# EasyEDA Pro project F405.epro

# Schematic Schematic1
Board Name: Board1; Create Date: 2024-12-15; Page Name: P1; Project Name: F405超微型飞控; Schematic Name: Schematic1; Update Date: 2025-01-16; Company: 嘉立创EDA; Page Size: A4; Version: V1.0
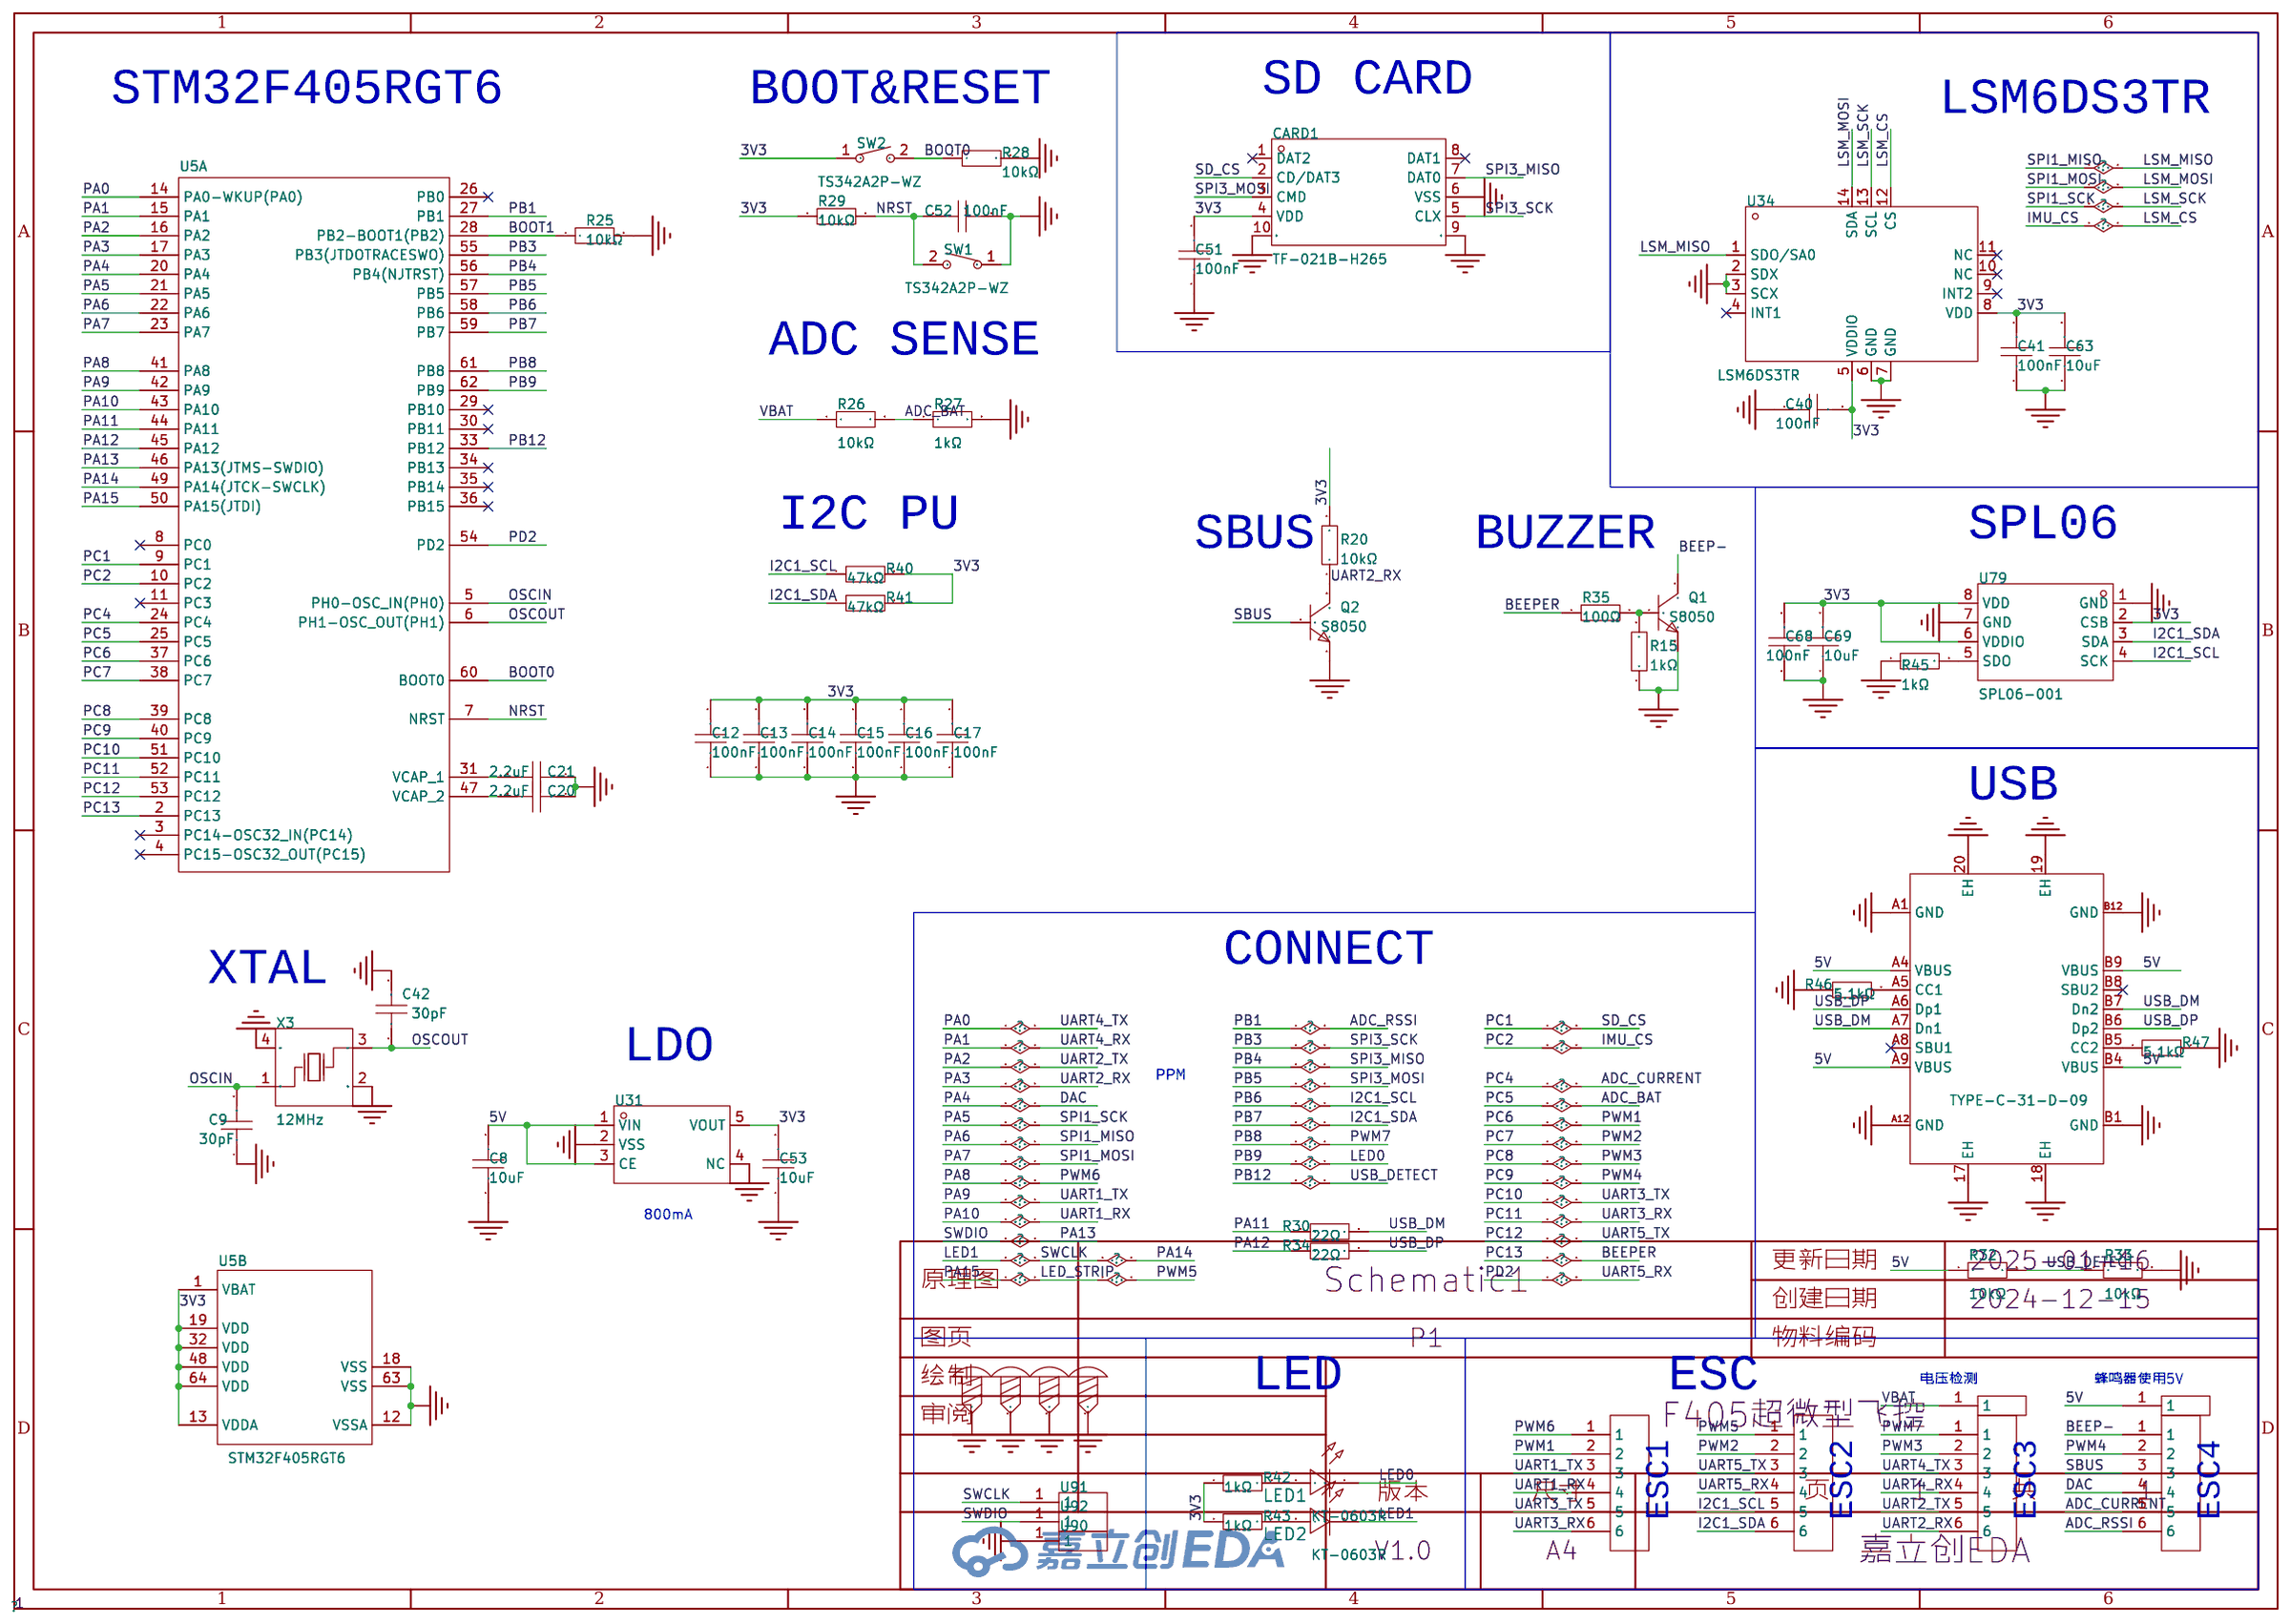
[diagram p0: schematic sheet]

## Parts
C8  10uF  [C0603]
C9  30pF  [C0603]
C12  100nF  [C0603]
C13  100nF  [C0603]
C14  100nF  [C0603]
C15  100nF  [C0603]
C16  100nF  [C0603]
C17  100nF  [C0603]
C20  2.2uF  [C0603]
C21  2.2uF  [C0603]
C40  100nF  [C0603]
C41  100nF  [C0603]
C42  30pF  [C0603]
C51  100nF  [C0603]
C52  100nF  [C0603]
C53  10uF  [C0603]
C63  10uF  [C0603]
C68  100nF  [C0603]
C69  10uF  [C0603]
CARD1  TF-021B-H265  [TF-SMD_TF-021B-H265]
LED1  KT-0603R  [LED0603-RD]
LED2  KT-0603R  [LED0603-RD]
Q1  S8050  [SOT-23-3_L2.9-W1.3-P1.90-LS2.4-BR]
Q2  S8050  [SOT-23-3_L2.9-W1.3-P1.90-LS2.4-BR]
R15  1kΩ  [R0603]
R20  10kΩ  [R0603]
R25  10kΩ  [R0603]
R26  10kΩ  [R0603]
R27  1kΩ  [R0603]
R28  10kΩ  [R0603]
R29  10kΩ  [R0603]
R30  22Ω  [R0603]
R32  10kΩ  [R0603]
R33  10kΩ  [R0603]
R34  22Ω  [R0603]
R35  100Ω  [R0603]
R40  47kΩ  [R0603]
R41  47kΩ  [R0603]
R42  1kΩ  [R0603]
R43  1kΩ  [R0603]
R45  1kΩ  [R0603]
R46  5.1kΩ  [R0603]
R47  5.1kΩ  [R0603]
SCREW1  -  [M3螺丝]
SCREW2  -  [M3螺丝]
SCREW3  -  [M3螺丝]
SCREW4  -  [M3螺丝]
SW1  TS342A2P-WZ  [SW-SMD_L4.0-W2.9-LS5.0]
SW2  TS342A2P-WZ  [SW-SMD_L4.0-W2.9-LS5.0]
U5  STM32F405RGT6  [LQFP-64_L10.0-W10.0-P0.50-LS12.0-BL]  (sections 1,2)
U31  ME6217C33M5G  [SOT-23-5_L3.0-W1.7-P0.95-LS2.8-BR]
U34  LSM6DS3TR  [LGA-14_L3.0-W2.5-P0.50-TL]
U79  SPL06-001  [SENSOR-SMD_SPL06-001]
U83  -  [6pin焊接引出]
U84  -  [6pin焊接引出]
U86  -  [6pin焊接引出]
U87  -  [6pin焊接引出]
U89  TYPE-C-31-D-09  [USB-C-TH_TYPE-C-31-D-09]
U90  -  [1pin焊接引出]
U91  -  [1pin焊接引出]
U92  -  [1pin焊接引出]
U93  -  [1pin焊接引出]
U94  -  [1pin焊接引出]
X3  12MHz  [CRYSTAL-SMD_4P-L3.2-W2.5-BL]

## Library data of the parts
C8 C53 C63 C69 = CL10A106KP8NNNC: 容值:10uF;精度:±10%;额定电压:10V;材质(温度系数):X5R;; LCSC Part Name: 10uF ±10% 10V; Supplier Part: C19702; Manufacturer: SAMSUNG(三星); Supplier Footprint: 0603; JLCPCB Part Class: Basic Part; Datasheet: https://atta.szlcsc.com/upload/public/pdf/source/20160218/1457707763339.pdf; Supplier: LCSC; Tolerance: ±10%; Voltage Rated: 10V; Temperature Coefficient: X5R
C9 C42 = 0603CG300J500NT: 容值:30pF;精度:±5%;额定电压:50V;材质(温度系数):C0G;; LCSC Part Name: 30pF ±5% 50V; Supplier Part: C1658; Manufacturer: FH(风华); Supplier Footprint: 0603; JLCPCB Part Class: Basic Part; Datasheet: https://atta.szlcsc.com/upload/public/pdf/source/20170923/C1658_1506149307366988446.pdf; Supplier: LCSC; Tolerance: ±5%; Voltage Rated: 50V; Temperature Coefficient: C0G
C12-C17 C40 C41 C51 C52 C68 = CC0603KRX7R9BB104: 容值:100nF;精度:±10%;额定电压:50V;材质(温度系数):X7R;; LCSC Part Name: 100nF ±10% 50V; Supplier Part: C14663; Manufacturer: YAGEO(国巨); Supplier Footprint: 0603; JLCPCB Part Class: Basic Part; Datasheet: https://atta.szlcsc.com/upload/public/pdf/source/20180910/C282072_33301C7F631E79921B82A8DAC6BCC5B3.pdf; Supplier: LCSC; Tolerance: ±10%; Voltage Rated: 50V; Temperature Coefficient: X7R
C20 C21 = CL10A225KO8NNNC: 容值:2.2uF;精度:±10%;额定电压:16V;材质(温度系数):X5R;; LCSC Part Name: 2.2uF ±10% 16V; Supplier Part: C23630; Manufacturer: SAMSUNG(三星); Supplier Footprint: 0603; JLCPCB Part Class: Basic Part; Datasheet: https://atta.szlcsc.com/upload/public/pdf/source/20160218/1457707763339.pdf; Supplier: LCSC; Tolerance: ±10%; Voltage Rated: 16V; Temperature Coefficient: X5R
CARD1 = TF-021B-H265: 卡连接方式:拔插式;卡类型:MicroSD卡(TF卡);连接器类型:卡座;本体最大高度:2.5mm;工作温度范围:-25℃~+75℃;; LCSC Part Name: 拔插式 MicroSD卡(TF卡) 卡座; Supplier Part: C498185; Manufacturer: SOFNG(硕方); Supplier Footprint: SMD; JLCPCB Part Class: 扩展库; Datasheet: https://atta.szlcsc.com/upload/public/pdf/source/20200318/C498185_790264C8C4D0E25CCBD64FEBD13A33FF.pdf; Supplier: LCSC; Card Connection Mode: 拔插式; Card Type: MicroSD卡(TF卡); Connector Type: 卡座; Maximum Body Height: 2.5mm; Operating Temperature Range: -25℃~+75℃
LED1 LED2 = KT-0603R: 发光颜色:红色;功率:-;正向电流:-;主波长:-;二极管配置:-;透镜颜色:-;色温:-;发光角度:-;载带方式:-;工作温度:-40℃~+85℃;; LCSC Part Name: 0603 红灯 高亮; Supplier Part: C2286; Manufacturer: KENTO; Supplier Footprint: 0603; JLCPCB Part Class: Basic Part; Datasheet: https://atta.szlcsc.com/upload/public/pdf/source/20160616/1466072038404.pdf; Supplier: LCSC; Emitted Color: 红色; Operating Temperature: -40℃~+85℃
Q1 Q2 = S8050_C2891804: 晶体管类型:NPN;集电极电流(Ic):500mA;集射极击穿电压(Vceo):25V;功率(Pd):300mW;; LCSC Part Name: NPN 电流:500mA 耐压:25V; Supplier Part: C2891804; Manufacturer: YONGYUTAI(永裕泰); Supplier Footprint: SOT-23; JLCPCB Part Class: 扩展库; Datasheet: https://atta.szlcsc.com/upload/public/pdf/source/20210901/5347316A10609C628D4D69AE01446E5B.pdf; Supplier: LCSC; Transistor Type: NPN; Collector Current (Ic): 500mA; Collector-Emitter Breakdown Voltage (Vceo): 25V; Power Dissipation (Pd): 300mW; Collector Cut-Off Current (Icbo): 1uA; Collector-Emitter Saturation Voltage (VCE(sat)@Ic,Ib): 500mV@500mA,50mA
R15 R27 R42 R43 R45 = 0603WAF1001T5E: 电阻类型:厚膜电阻;阻值:1kΩ;精度:±1%;功率:100mW;最大工作电压:75V;温度系数:±100ppm/℃;; LCSC Part Name: 1kΩ ±1% 100mW 厚膜电阻; Supplier Part: C21190; Manufacturer: UNI-ROYAL(厚声); Supplier Footprint: 0603; JLCPCB Part Class: Basic Part; Datasheet: https://atta.szlcsc.com/upload/public/pdf/source/20200306/C422600_1E6D84923E4A46A82E41ADD87F860B5C.pdf; Supplier: LCSC; Type: 厚膜电阻; Tolerance: ±1%; Power(Watts): 100mW; Overload Voltage (Max): 75V; Temperature Coefficient: ±100ppm/℃; Operating Temperature Range: -55℃~+155℃
R20 R25 R26 R28 R29 R32 R33 = 0603WAF1002T5E: 电阻类型:厚膜电阻;阻值:10kΩ;精度:±1%;功率:100mW;最大工作电压:75V;温度系数:±100ppm/℃;; LCSC Part Name: 厚膜电阻 10kΩ ±1% 100mW; Supplier Part: C25804; Manufacturer: UNI-ROYAL(厚声); Supplier Footprint: 0603; JLCPCB Part Class: Basic Part; Datasheet: https://atta.szlcsc.com/upload/public/pdf/source/20200306/C422600_1E6D84923E4A46A82E41ADD87F860B5C.pdf; Supplier: LCSC; Type: 厚膜电阻; Tolerance: ±1%; Power(Watts): 100mW; Overload Voltage (Max): 75V; Temperature Coefficient: ±100ppm/℃; Operating Temperature Range: -55℃~+155℃
R30 R34 = 0603WAF220JT5E: 电阻类型:厚膜电阻;阻值:22Ω;精度:±1%;功率:100mW;最大工作电压:75V;温度系数:±100ppm/℃;; LCSC Part Name: 22Ω ±1% 100mW 厚膜电阻; Supplier Part: C23345; Manufacturer: UNI-ROYAL(厚声); Supplier Footprint: 0603; JLCPCB Part Class: Basic Part; Datasheet: https://atta.szlcsc.com/upload/public/pdf/source/20200306/C422600_1E6D84923E4A46A82E41ADD87F860B5C.pdf; Supplier: LCSC; Type: 厚膜电阻; Tolerance: ±1%; Power(Watts): 100mW; Overload Voltage (Max): 75V; Temperature Coefficient: ±100ppm/℃; Operating Temperature Range: -55℃~+155℃
R35 = 0603WAF1000T5E: 电阻类型:厚膜电阻;阻值:100Ω;精度:±1%;功率:100mW;最大工作电压:75V;温度系数:±200ppm/℃;; LCSC Part Name: 100Ω ±1% 100mW 厚膜电阻; Supplier Part: C22775; Manufacturer: UNI-ROYAL(厚声); Supplier Footprint: 0603; JLCPCB Part Class: Basic Part; Datasheet: https://atta.szlcsc.com/upload/public/pdf/source/20200306/C422600_1E6D84923E4A46A82E41ADD87F860B5C.pdf; Supplier: LCSC; Type: 厚膜电阻; Tolerance: ±1%; Power(Watts): 100mW; Overload Voltage (Max): 75V; Temperature Coefficient: ±200ppm/℃; Operating Temperature Range: -55℃~+155℃
R40 R41 = 0603WAF4702T5E: 电阻类型:厚膜电阻;阻值:47kΩ;精度:±1%;功率:100mW;最大工作电压:75V;温度系数:±100ppm/℃;; LCSC Part Name: 47kΩ ±1% 100mW 厚膜电阻; Supplier Part: C25819; Manufacturer: UNI-ROYAL(厚声); Supplier Footprint: 0603; JLCPCB Part Class: Basic Part; Datasheet: https://atta.szlcsc.com/upload/public/pdf/source/20200306/C422600_1E6D84923E4A46A82E41ADD87F860B5C.pdf; Supplier: LCSC; Type: 厚膜电阻; Tolerance: ±1%; Power(Watts): 100mW; Overload Voltage (Max): 75V; Temperature Coefficient: ±100ppm/℃; Operating Temperature Range: -55℃~+155℃
R46 R47 = 0603WAF5101T5E: 电阻类型:厚膜电阻;阻值:5.1kΩ;精度:±1%;功率:100mW;最大工作电压:75V;温度系数:±100ppm/℃;; LCSC Part Name: 5.1kΩ ±1% 100mW 厚膜电阻; Supplier Part: C23186; Manufacturer: UNI-ROYAL(厚声); Supplier Footprint: 0603; JLCPCB Part Class: Basic Part; Datasheet: https://atta.szlcsc.com/upload/public/pdf/source/20200306/C422600_1E6D84923E4A46A82E41ADD87F860B5C.pdf; Supplier: LCSC; Type: 厚膜电阻; Tolerance: ±1%; Power(Watts): 100mW; Overload Voltage (Max): 75V; Temperature Coefficient: ±100ppm/℃; Operating Temperature Range: -55℃~+155℃
SCREW1-SCREW4 = M3螺丝: Supplier Footprint: 插件; Check: false
SW1 SW2 = TS342A2P-WZ: 电路结构:单刀单掷;按钮形状:圆形按钮;安装方式:立贴;开关长度:3.95mm;开关宽度:2.9mm;开关高度:2mm;带支架:不带;触点电流:50mA;额定电压(DC):12V;绝缘电阻:100MΩ;机械寿命:3万次;; LCSC Part Name: 3.95*2.9*2mm 立贴 轻触开关; Supplier Part: C557591; Manufacturer: SHOU HAN(首韩); Supplier Footprint: SMD; JLCPCB Part Class: 扩展库; Datasheet: https://atta.szlcsc.com/upload/public/pdf/source/20200519/C557591_B3A5A21584733303F06306F18577DA8B.pdf; Supplier: LCSC; Circuit: 单刀单掷; Actuator Style: 圆形按钮; Mounting Style: 立贴; Switch Length: 3.95mm; Switch Width: 2.9mm; Switch Height: 2mm; Strike Gundam: 不带; Contact Current: 50mA; Voltage Rating (DC): 12V; Insulation Resistance: 100MΩ; Actuator/Cap Color: 黑色; Pin Style: SMD接片; Mechanical Life: 3万次; Operating Temperature: -25℃~+70℃
U5 = STM32F405RGT6: CPU内核:ARM Cortex-M4;CPU最大主频:168MHz;工作电压范围:1.8V~3.6V;内部振荡器:有;程序 FLASH容量:1MB;RAM总容量:192KB;EEPROM/数据 FLASH容量:-;GPIO端口数量:51;ADC(单元数/通道数/位数):1@x16ch/12bit;DAC(单元数/通道数/位数):1@x2ch/12bit;外设/功能/协议栈:欠压检测/复位；DMA；LCD驱动；看门狗；POR；PWM;工作温度范围:-40℃~+85℃;; LCSC Part Name: ARM Cortex-M4 168MHz 闪存：1MB RAM：192KB; Supplier Part: C15742; Manufacturer: ST(意法半导体); Supplier Footprint: LQFP-64(10x10); JLCPCB Part Class: 扩展库; Datasheet: https://atta.szlcsc.com/upload/public/pdf/source/20140724/1457707160365.pdf; Supplier: LCSC; CPU Core: ARM Cortex-M4; CPU Maximum Speed: 168MHz; Operating Voltage Range: 1.8V~3.6V; Program Storage Size: 1MB; Program Memory Type: FLASH; RAM Size: 192KB; GPIO Ports Number: 51; ADC (Bit): 12bit; DAC (Bit): 12bit; Universal Serial Bus: 有; Peripheral/Function: DMA；LCD/LED驱动；PWM; Watchdog: 有; Infrared Data Association: 有; Low-Voltage Detect: 有; LCD Module: 有; Direct Memory Access: 有; Internal Oscillator: 有; Operating Temperature Range: -40℃~+85℃; Maximum Frequency: 168MHz; Supply Voltage Range: 1.8V~3.6V; Program FLASH Size: 1MB; ADC (Units/Channels/bits): 1@x16ch/12bit; DAC (Units/Channels/bits): 1@x2ch/12bit; Peripherals / Functions / Protocol Stacks: 欠压检测/复位；DMA；LCD驱动；看门狗；POR；PWM
U31 = ME6217C33M5G: 输出类型:固定;输出极性:正;最大输入电压:7V;输出电压:3.3V;输出电流:800mA;电源纹波抑制比(PSRR):65dB@(1kHz);; Supplier Part: C427602; Manufacturer: MICRONE(南京微盟); Supplier Footprint: SOT-23-5; JLCPCB Part Class: 扩展库; Datasheet: https://atta.szlcsc.com/upload/public/pdf/source/20190910/C427602_D4B9162A2E9D9EF57C60010DFDECEF37.pdf; Supplier: LCSC; Output Type: 固定; Output Polarity: 正; Number of Outputs: 1; Maximum Input Voltage: 7V; Output Voltage: 3.3V; Dropout Voltage: 180mV@(300mA); Output Current: 800mA; Power Supply Rejection Ratio (PSRR): 65dB@(1kHz)
U34 = LSM6DS3TR: 传感器类型:加速度计陀螺仪;; LCSC Part Name: LSM6DS3TR MSL=3; Supplier Part: C95230; Manufacturer: ST(意法半导体); Supplier Footprint: LGA-14(2.5x3); JLCPCB Part Class: 扩展库; Datasheet: https://atta.szlcsc.com/upload/public/pdf/source/20180410/C95230_E9546B888C12D8CC6F7F231B3BE24882.pdf; Supplier: LCSC; Sensor Type: 加速度计陀螺仪; Operating Temperature: -40℃~+85℃
U79 = SPL06-001_C2684428: LCSC Part Name: 普通气压传感器 停产; Supplier Part: C2684428; Manufacturer: Goertek(歌尔); Supplier Footprint: LGA-8(2x2.5); JLCPCB Part Class: 扩展库; Datasheet: https://atta.szlcsc.com/upload/public/pdf/source/20210120/C2684428_7EA58BBCA3793458F617124FBE4BF8F1.pdf; Supplier: LCSC; Operating Temperature: -40℃~+85℃
U83 U84 U86 U87 = 6pin焊接引出: Check: false
U89 = TYPE-C-31-D-09_C7463258: 连接器类型:Type-C;公母:母;触点数量:16P;端口数量:1;触头材质:磷青铜;触头镀层:金;工作温度范围:-25℃~+85℃;焊接温度(最大值):255℃;; LCSC Part Name: Type-C 母; Supplier Part: C7463258; Manufacturer: 韩国韩荣; Supplier Footprint: 插件; JLCPCB Part Class: 扩展库; Datasheet: https://atta.szlcsc.com/upload/public/pdf/source/20210810/32473655767ED7E058BB8A709ED63A8A.pdf; Supplier: LCSC; Connector Type: Type-C; Gender: 母; Number of Contacts: 16P; Number of Ports: 1; Contact Material: 磷青铜; Contact Plating: 金; Operating Temperature Range: -25℃~+85℃; Soldering Temperature(Max): 255℃
U90-U94 = 1pin焊接引出: Check: false
X3 = X322512MSB4SI: 晶振类型:贴片晶振;频率:12MHz;常温频差:±10ppm;外接负载电容:20pF;频率稳定度(全温):±20ppm;; LCSC Part Name: 12MHz ±10ppm 20pF; Supplier Part: C9002; Manufacturer: YXC(扬兴晶振); Supplier Footprint: SMD3225-4P; JLCPCB Part Class: 基础库; Datasheet: https://atta.szlcsc.com/upload/public/pdf/source/20240329/19D5F850207469550BEB00D7DFEDBC7A.pdf; Supplier: LCSC; Crystal Type: 贴片晶振; Normal temperature Frequency Tolerance: ±10ppm; External load capacitor: 20pF; Frequency Stability(Full temperature range): ±20ppm; Operating Temperature: -40℃~+85℃

## Nets
3V3: C12.2 C13.2 C14.2 C15.2 C16.2 C17.2 C40.2 C41.2 C51.2 C53.2 C63.2 C68.2 C69.2 CARD1.4(VDD) R20.2 R29.1 R40.2 R41.2 R42.1 R43.1 SW2.1 U5.1(VBAT) U5.13(VDDA) U5.19(VDD) U5.32(VDD) U5.48(VDD) U5.64(VDD) U31.5(VOUT) U34.5(VDDIO) U34.8(VDD) U79.2(CSB) U79.6(VDDIO) U79.8(VDD)
5V: C8.2 R32.1 U31.1(VIN) U31.3(CE) U89.A4(VBUS) U89.A9(VBUS) U89.B4(VBUS) U89.B9(VBUS) U93.1
GND: C8.1 C9.1 C12.1 C13.1 C14.1 C15.1 C16.1 C17.1 C20.1 C21.1 C40.1 C41.1 C42.2 C51.1 C52.2 C53.1 C63.1 C68.1 C69.1 CARD1.6(VSS) CARD1.9 CARD1.10 Q1.2(E) Q2.2(E) R15.1 R25.2 R27.2 R28.2 R33.2 R45.1 R46.1 R47.2 SCREW1.1 SCREW2.1 SCREW3.1 SCREW4.1 SW1.1 U5.12(VSSA) U5.18(VSS) U5.63(VSS) U31.2(VSS) U31.4(NC) U34.2(SDX) U34.3(SCX) U34.6(GND) U34.7(GND) U79.1(GND) U79.7(GND) U89.17(EH) U89.18(EH) U89.19(EH) U89.20(EH) U89.A1(GND) U89.A12(GND) U89.B1(GND) U89.B12(GND) U90.1 X3.2(GND) X3.4(GND)
VBAT: R26.1 U94.1
ADC_BAT: R26.2 R27.1 U5.25(PC5)
ADC_CURRENT: U5.24(PC4) U86.5
ADC_RSSI: U5.27(PB1) U86.6
BEEP-: Q1.3(C) U86.1
BEEPER: R35.1 U5.2(PC13)
BOOT0: R28.1 SW2.2 U5.60(BOOT0)
BOOT1: R25.1 U5.28(PB2-BOOT1(PB2))
DAC: U5.20(PA4) U86.4
I2C1_SCL: R40.1 U5.58(PB6) U79.4(SCK) U84.5
I2C1_SDA: R41.1 U5.59(PB7) U79.3(SDA) U84.6
IMU_CS: U5.10(PC2) U34.12(CS)
LED0: LED1.1(C) U5.62(PB9)
LED1: LED2.1(C) U5.49(PA14(JTCK-SWCLK)) U91.1
LED_STRIP: U5.50(PA15(JTDI)) U84.1
LSM_MISO: U5.22(PA6) U34.1(SDO/SA0)
LSM_MOSI: U5.23(PA7) U34.14(SDA)
LSM_SCK: U5.21(PA5) U34.13(SCL)
NRST: C52.1 R29.2 SW1.2 U5.7(NRST)
OSCIN: C9.2 U5.5(PH0-OSC_IN(PH0)) X3.1(OSC1)
OSCOUT: C42.1 U5.6(PH1-OSC_OUT(PH1)) X3.3(OSC2)
PA0: U5.14(PA0-WKUP(PA0)) U87.3
PA1: U5.15(PA1) U87.4
PA2: U5.16(PA2) U87.5
PA3: Q2.3(C) R20.1 U5.17(PA3) U87.6
PA8: U5.41(PA8) U83.1
PA9: U5.42(PA9) U83.3
PA10: U5.43(PA10) U83.4
PA11: R30.1 U5.44(PA11)
PA12: R34.1 U5.45(PA12)
PA13: U5.46(PA13(JTMS-SWDIO)) U92.1
PB3: CARD1.5(CLX) U5.55(PB3(JTDOTRACESWO))
PB4: CARD1.7(DAT0) U5.56(PB4(NJTRST))
PB5: CARD1.3(CMD) U5.57(PB5)
PB8: U5.61(PB8) U87.1
PB12: R32.2 R33.1 U5.33(PB12)
PC1: CARD1.2(CD/DAT3) U5.9(PC1)
PC6: U5.37(PC6) U83.2
PC7: U5.38(PC7) U84.2
PC8: U5.39(PC8) U87.2
PC9: U5.40(PC9) U86.2
PC10: U5.51(PC10) U83.5
PC11: U5.52(PC11) U83.6
PC12: U5.53(PC12) U84.3
PD2: U5.54(PD2) U84.4
SBUS: Q2.1(B) U86.3
USB_DM: R30.2 U89.A7(Dn1) U89.B7(Dn2)
USB_DP: R34.2 U89.A6(Dp1) U89.B6(Dp2)
$1N7139: C20.2 U5.47(VCAP_2)
$1N7140: C21.2 U5.31(VCAP_1)
$1N7387: Q1.1(B) R15.2 R35.2
$1N7752: LED1.2(A) R42.2
$1N7753: LED2.2(A) R43.2
$1N11868: R45.2 U79.5(SDO)
$1N12580: R46.2 U89.A5(CC1)
$1N12606: R47.1 U89.B5(CC2)

Not connected (* = marked no-connect by the designer): CARD1 1(DAT2)* 8(DAT1)*; U5 3(PC14-OSC32_IN(PC14))* 4(PC15-OSC32_OUT(PC15))* 8(PC0)* 11(PC3)* 26(PB0)* 29(PB10)* 30(PB11)* 34(PB13)* 35(PB14)* 36(PB15)*; U34 4(INT1)* 9(INT2)* 10(NC)* 11(NC)*; U89 A8(SBU1)* B8(SBU2)*

## Notes on the sheet
- SD CARD
- STM32F405RGT6
- BOOT&RESET
- LSM6DS3TR
- ADC SENSE
- I2C PU
- SBUS
- BUZZER
- SPL06
- USB
- CONNECT
- XTAL
- LDO
- PPM
- 800mA
- 电压检测
- 蜂鸣器使用5V
- LED
- ESC
- ESC1
- ESC2
- ESC3
- ESC4

# Board PCB1
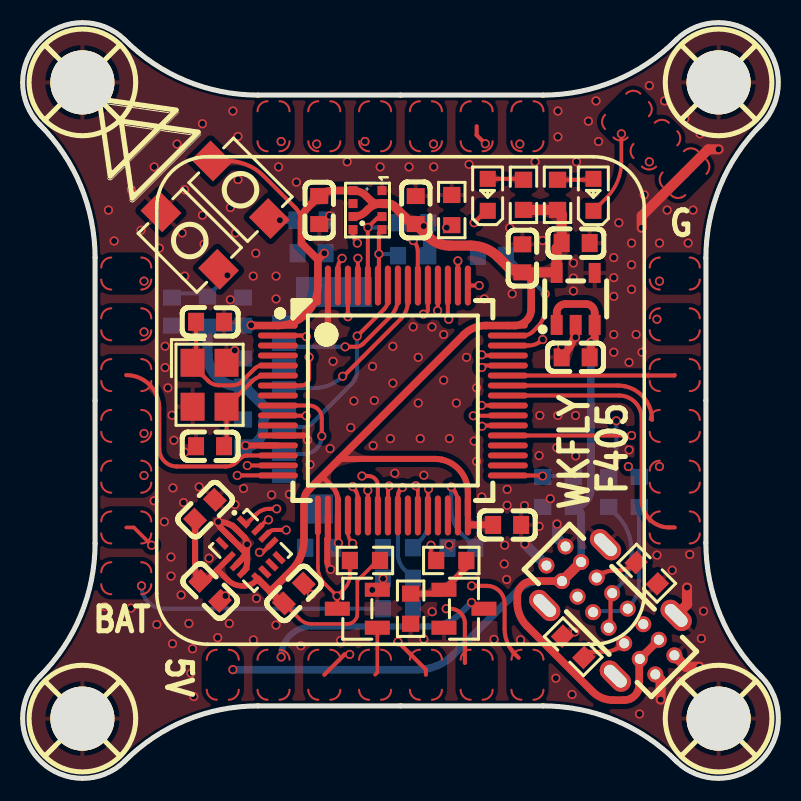
[diagram p1: board, top side]
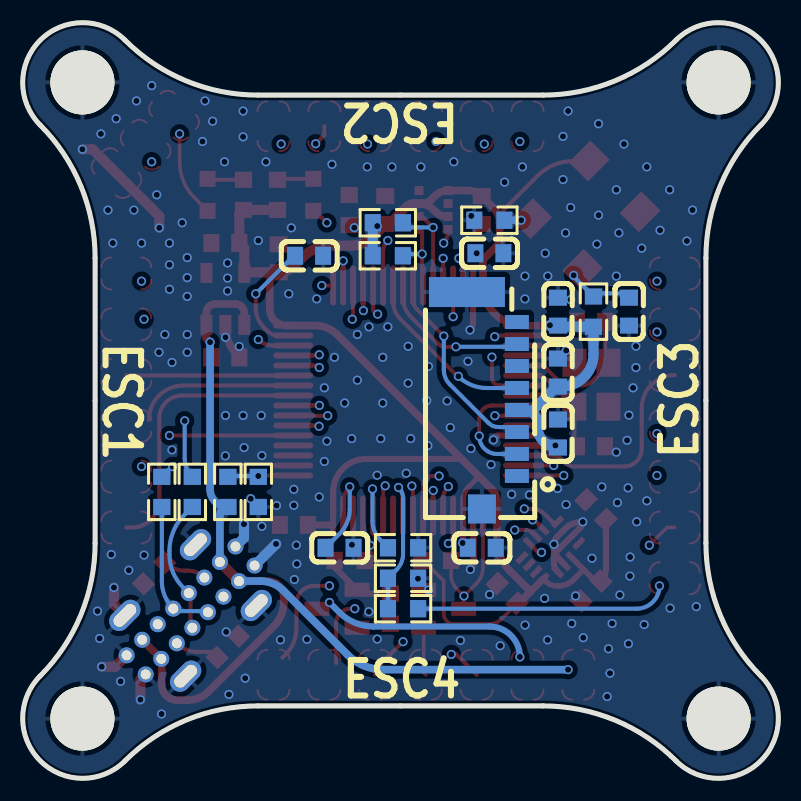
[diagram p2: board, bottom side, seen from below]

Outline 37.82 x 37.82 mm; copper layers: Top Layer, Inner1, Inner2, Bottom Layer. Coordinates in mm from the lower left corner of the outline.
Outline path: 0.88,32.7 arc(2.92,29.65) 3.64,26.05 3.64,11.78 arc(2.92,8.18) 0.88,5.12 arc(0.88,0.88) 5.12,0.88 arc(8.18,2.92) 11.78,3.64 26.05,3.64 arc(29.65,2.92) 32.7,0.88 arc(36.94,0.88) 36.94,5.12 arc(34.9,8.18) 34.19,11.78 34.19,26.05 arc(34.9,29.65) 36.94,32.7 arc(36.94,36.94) 32.7,36.94 arc(29.65,34.9) 26.05,34.19 11.78,34.19 arc(8.18,34.9) 5.12,36.94 arc(0.88,36.94) 0.88,32.7
Stack: Top Layer 0.035mm 外层铜厚1oz / Dielectric1 0.2104mm 7628 RC49% 8.6mil / Inner1 0.0152mm 内层铜厚 / Dielectric2 1.065mm 1.1mm H/HOZ Copper / Inner2 0.0152mm 内层铜厚 / Dielectric3 0.2104mm 7628 RC49% 8.6mil / Bottom Layer 0.035mm 外层铜厚1oz

## Design rules (mm)
template: 自定义配置
spacing copperThickness1oz (default): track to track 0.102, other pairs 0.152 to 0.3
spacing copperThickness2oz: track to track 0.203, other pairs 0.152 to 0.3
track width copperThickness1oz (default): min 0.127, default 0.254, max 2.54
track width copperThickness2oz: min 0.203, default 0.254, max 2.54
differential pair differentialPair (default): width min 0.127, default 0.254, max 2.54; gap min 0.152, default 0.152
via viaSize (default): diameter min 0.254, default 0.457, max 10; hole min 0.3, default 0.305, max 6.3

## Placement (name value [footprint] x y rotation side)
C8  10uF  [C0603]  27.67 21.07 0 top
C9  30pF  [C0603]  9.39 22.85 180 top
C12  100nF  [C0603]  11.04 17.26 270 bottom
C13  100nF  [C0603]  27.67 26.79 180 top
C14  100nF  [C0603]  24.25 12.69 180 top
C15  100nF  [C0603]  14.85 11.55 0 bottom
C16  100nF  [C0603]  11.04 23.36 270 bottom
C17  100nF  [C0603]  14.47 26.28 0 bottom
C20  2.2uF  [C0603]  23.48 26.15 0 bottom
C21  2.2uF  [C0603]  21.96 11.55 0 bottom
C40  100nF  [C0603]  9.13 13.45 225 top
C41  100nF  [C0603]  9.39 9.39 135 top
C42  30pF  [C0603]  9.39 16.63 180 top
C51  100nF  [C0603]  11.04 20.31 270 bottom
C52  100nF  [C0603]  7.48 23.36 270 bottom
C53  10uF  [C0603]  25.01 26.02 270 top
C63  10uF  [C0603]  13.58 9.26 225 top
C68  100nF  [C0603]  19.67 28.44 270 top
C69  10uF  [C0603]  14.85 28.44 90 top
CARD1  TF-021B-H265  [TF-SMD_TF-021B-H265]  14.34 18.91 270 bottom
LED1  KT-0603R  [LED0603-RD]  23.27 29.2 90 top
LED2  KT-0603R  [LED0603-RD]  28.56 29.2 90 top
Q1  S8050  [SOT-23-3_L2.9-W1.3-P1.90-LS2.4-BR]  22.09 8.5 180 top
Q2  S8050  [SOT-23-3_L2.9-W1.3-P1.90-LS2.4-BR]  16.75 8.5 0 top
R15  1kΩ  [R0603]  19.42 8.5 90 top
R20  10kΩ  [R0603]  17.13 10.91 0 top
R25  10kΩ  [R0603]  18.78 11.55 180 bottom
R26  10kΩ  [R0603]  18.78 8.5 0 bottom
R27  1kΩ  [R0603]  18.78 10.02 180 bottom
R28  10kΩ  [R0603]  14.47 27.93 0 bottom
R29  10kΩ  [R0603]  9.26 23.36 90 bottom
R30  22Ω  [R0603]  30.85 14.34 270 bottom
R32  10kΩ  [R0603]  27.55 14.34 90 bottom
R33  10kΩ  [R0603]  26.02 14.34 270 bottom
R34  22Ω  [R0603]  29.33 14.34 270 bottom
R35  100Ω  [R0603]  21.45 10.91 0 top
R40  47kΩ  [R0603]  19.55 26.15 0 bottom
R41  47kΩ  [R0603]  19.55 27.8 0 bottom
R42  1kΩ  [R0603]  25.06 29.2 90 top
R43  1kΩ  [R0603]  26.77 29.2 90 top
R45  1kΩ  [R0603]  21.48 28.44 270 top
R46  5.1kΩ  [R0603]  27.55 6.59 315 top
R47  5.1kΩ  [R0603]  31.23 10.28 315 top
SCREW1  -  [M3螺丝]  34.82 34.82 0 top
SCREW2  -  [M3螺丝]  34.82 3 0 top
SCREW3  -  [M3螺丝]  3 3 0 top
SCREW4  -  [M3螺丝]  3 34.82 0 top
SW1  TS342A2P-WZ  [SW-SMD_L4.0-W2.9-LS5.0]  8.37 26.91 315 top
SW2  TS342A2P-WZ  [SW-SMD_L4.0-W2.9-LS5.0]  10.91 29.45 315 top
U5  STM32F405RGT6  [LQFP-64_L10.0-W10.0-P0.50-LS12.0-BL]  18.53 18.91 270 top
U31  ME6217C33M5G  [SOT-23-5_L3.0-W1.7-P0.95-LS2.8-BR]  27.67 23.99 270 top
U34  LSM6DS3TR  [LGA-14_L3.0-W2.5-P0.50-TL]  11.41 11.41 315 top
U79  SPL06-001  [SENSOR-SMD_SPL06-001]  17.26 28.44 90 top
U83  -  [6pin焊接引出]  32.63 16.37 0 top
U84  -  [6pin焊接引出]  21.45 32.63 90 top
U86  -  [6pin焊接引出]  16.37 5.2 270 top
U87  -  [6pin焊接引出]  5.2 21.45 180 top
U89  TYPE-C-31-D-09  [USB-C-TH_TYPE-C-31-D-09]  29.41 8.41 135 top
U90  -  [1pin焊接引出]  33.12 30.28 45 top
U91  -  [1pin焊接引出]  30.24 33.16 45 top
U92  -  [1pin焊接引出]  31.66 31.71 45 top
U93  -  [1pin焊接引出]  10.02 5.2 90 top
U94  -  [1pin焊接引出]  5.2 10.02 0 top
X3  12MHz  [CRYSTAL-SMD_4P-L3.2-W2.5-BL]  9.36 19.7 270 top

## Footprints (pads in the part's own frame, mm; a bottom-side part is the same pattern mirrored in y, then rotated)
1pin焊接引出
  custom 2.5x1.6 smd: 1(0,0)
6pin焊接引出
  custom 2.5x1.6 smd: 1(0,-3.81) 2(0,-1.27) 3(0,1.27) 4(0,3.81) 5(0,6.35) 6(0,8.89)
C0603
  rect 0.8x0.9 smd: 1(-0.7,0) 2(0.7,0)
CRYSTAL-SMD_4P-L3.2-W2.5-BL
  rect 1.4x1.2 smd: 1(-1.1,-0.85) 2(1.1,-0.85) 3(1.1,0.85) 4(-1.1,0.85)
LED0603-RD
  rect 0.8x0.8 smd: 1(-0.799,0) 2(0.799,0)
LGA-14_L3.0-W2.5-P0.50-TL
  rect 0.675x0.28 smd: 1(-1.262,0.75) 2(-1.262,0.25) 3(-1.262,-0.25) 4(-1.262,-0.75) 8(1.262,-0.75) 9(1.262,-0.25) 10(1.262,0.25) 11(1.262,0.75)
  rect 0.28x0.675 smd: 5(-0.5,-1.012) 6(0,-1.013) 7(0.5,-1.012) 12(0.5,1.012) 13(0,1.013) 14(-0.5,1.012)
LQFP-64_L10.0-W10.0-P0.50-LS12.0-BL
  oval 0.3x2 smd: 1(-3.75,-5.75) 2(-3.25,-5.75) 3(-2.75,-5.75) 4(-2.25,-5.75) 5(-1.75,-5.75) 6(-1.25,-5.75) 7(-0.75,-5.75) 8(-0.25,-5.75) 9(0.25,-5.75) 10(0.75,-5.75) 11(1.25,-5.75) 12(1.75,-5.75) 13(2.25,-5.75) 14(2.75,-5.75) 15(3.25,-5.75) 16(3.75,-5.75) 33(3.75,5.75) 34(3.25,5.75) 35(2.75,5.75) 36(2.25,5.75) 37(1.75,5.75) 38(1.25,5.75) 39(0.75,5.75) 40(0.25,5.75) 41(-0.25,5.75) 42(-0.75,5.75) 43(-1.25,5.75) 44(-1.75,5.75) 45(-2.25,5.75) 46(-2.75,5.75) 47(-3.25,5.75) 48(-3.75,5.75)
  oval 2x0.3 smd: 17(5.75,-3.75) 18(5.75,-3.25) 19(5.75,-2.75) 20(5.75,-2.25) 21(5.75,-1.75) 22(5.75,-1.25) 23(5.75,-0.75) 24(5.75,-0.25) 25(5.75,0.25) 26(5.75,0.75) 27(5.75,1.25) 28(5.75,1.75) 29(5.75,2.25) 30(5.75,2.75) 31(5.75,3.25) 32(5.75,3.75) 49(-5.75,3.75) 50(-5.75,3.25) 51(-5.75,2.75) 52(-5.75,2.25) 53(-5.75,1.75) 54(-5.75,1.25) 55(-5.75,0.75) 56(-5.75,0.25) 57(-5.75,-0.25) 58(-5.75,-0.75) 59(-5.75,-1.25) 60(-5.75,-1.75) 61(-5.75,-2.25) 62(-5.75,-2.75) 63(-5.75,-3.25) 64(-5.75,-3.75)
M3螺丝
  round 3.2 hole 3.2: 1(0,0)
R0603
  rect 0.806x0.864 smd: 1(-0.753,0) 2(0.753,0)
SENSOR-SMD_SPL06-001
  rect 0.45x0.45 smd: 1(0.975,-0.725) 2(0.325,-0.725) 3(-0.325,-0.725) 4(-0.975,-0.725) 5(-0.975,0.725) 6(-0.325,0.725) 7(0.325,0.725) 8(0.975,0.725)
SOT-23-3_L2.9-W1.3-P1.90-LS2.4-BR
  rect 1.25x0.7 smd: 1(1,-0.95) 2(1,0.95) 3(-1,0)
SOT-23-5_L3.0-W1.7-P0.95-LS2.8-BR
  rect 1x0.6 smd: 1(1.3,-0.95) 2(1.3,0) 3(1.3,0.95) 4(-1.3,0.95) 5(-1.3,-0.95)
SW-SMD_L4.0-W2.9-LS5.0
  rect 1.53x1.36 smd: 1(-2.035,0) 2(2.035,0)
TF-SMD_TF-021B-H265
  rect 0.7x1.2 smd: 1(3.775,1.25) 2(2.675,1.25) 3(1.575,1.25) 4(0.475,1.25) 5(-0.625,1.25) 6(-1.725,1.25) 7(-2.825,1.25) 8(-3.925,1.25)
  rect 1.5x3.8 smd: 9(-5.425,-1.25)
  rect 1.45x1.4 smd: 10(5.425,-0.5)
USB-C-TH_TYPE-C-31-D-09
  oval 1.8x1 hole 1.365x0.6: 17(2.5,2.15) 18(-2.5,2.15) 19(-2.5,-2.15) 20(2.5,-2.15)
  round 0.8 hole 0.5: A1(-3.85,0.675) A4(-2.75,0.675) A5(-1.65,0.675) A6(-0.55,0.675) A7(0.55,0.675) A8(1.65,0.675) A9(2.75,0.675) A12(3.85,0.675) B1(3.85,-0.675) B4(2.75,-0.675) B5(1.65,-0.675) B6(0.55,-0.675) B7(-0.55,-0.675) B8(-1.65,-0.675) B9(-2.75,-0.675) B12(-3.85,-0.675)

## Nets
As in the schematic.

Pads without a net: CARD1 1 8; U5 3 4 8 11 26 29 30 34 35 36; U34 4 9 10 11; U89 A8 B8

## Via types
v1: diameter 0.457, hole 0.305, Top Layer to Bottom Layer, 257 vias

## Routing (per net, layer and track width the routed paths; a pad name or vN(x,y) marks a point on that pad's centre or on a via; arc(x,y) is an arc through that point)
3V3: length 102.6
  Top Layer w0.178: 18.14,10.91 17.77,10.91 16.75,9.89 16.75,8.24 arc(16.75,8.17) 16.73,8.09 arc(16.6,7.88) 16.39,7.76 arc(16.32,7.74) 16.24,7.74 14.48,7.74 arc(14.14,7.8) 13.85,7.99 13.08,8.76
  Top Layer w0.203: SW2.1 10.26,30.89 arc(11.23,30.7) 12.06,30.15 13.65,28.55 arc(13.88,28.21) 13.96,27.82
  Top Layer w0.254: 15.02,15.08 15.49,14.61 arc(15.7,14.29) 15.77,13.92
  Top Layer w0.28: U34.5 9.75,10.46 ; 9.75,10.46 10.26,9.94 arc(10.6,9.72) 10.99,9.64 11.12,9.64 arc(11.4,9.7) 11.64,9.85 U34.8 ; 9.75,10.46 9.17,9.88 C41.2
  Top Layer w0.305: U5.19 15.78,11.85 arc(15.79,11.81) v1(15.81,11.79) ; U5.32 22.28,14.33 arc(22.27,14.51) 22.24,14.69 arc(21.8,15.51) 20.98,15.95 arc(20.8,15.98) 20.63,15.99 15.86,15.99 ; U5.13 v1(11.16,16.66) ; C40.2 8.64,10.49 arc(8.7,10.16) C41.2
  Top Layer w0.355: C14.2 22.36,12.69 arc(22.34,12.68) 22.33,12.66 ; U34.8 12.4,9.36
  Top Layer w0.381: 17.19,29.14 17.38,28.95 arc(17.59,28.81) 17.83,28.76 U79.2 arc(17.6,28.69) 17.28,28.47 17.17,28.36 arc(16.89,28.18) 16.57,28.11 U79.6 ; 14.78,25.96 13.96,26.78 13.96,27.82 arc(14.04,28.21) 14.26,28.55 14.85,29.14 arc(15.15,29.34) 15.51,29.41 U79.8 arc(16.89,29.34) 17.19,29.14 ; 14.78,25.96 v1(15.1,26.28) ; 14.78,25.96 U5.64 arc(14.19,23.25) U5.1 11.45,22.66 v1(11.44,22.68) ; 13.08,8.76 13,8.76 12.4,9.36 12.41,9.36 13.44,10.4 arc(13.92,11.11) 14.09,11.94 14.09,13.87 arc(14.15,14.19) 14.32,14.45 22.07,22.2 arc(22.58,22.54) 23.19,22.66 U5.48 24.63,22.66 arc(25.21,22.9) 25.45,23.48 25.45,24.88 arc(25.32,25.19) C53.2
  Top Layer w0.457: C68.2 19.48,27.74 18.63,28.59 arc(18.44,28.72) 18.21,28.76 U79.2
  Top Layer w0.508: C68.2 20.31,27.1 arc(20.8,26.77) 21.38,26.66 22.4,26.66 arc(23.17,26.51) 23.81,26.07 24.25,25.64 arc(24.6,25.4) C53.2 26.69,25.32 26.72,25.29 26.72,26.54 C13.2 26.97,28.24 R43.1 R42.1
  Bottom Layer w0.381: v1(15.1,26.28) C17.2
  Bottom Layer w0.508: 20.3,26.28 R41.2 ; v1(11.44,22.68) 11.37,22.6 R29.1 9.26,21.22 arc(9.73,20.08) 10.87,19.61 C51.2 11.1,19.61 12.27,18.44 ; C12.2 arc(11.6,16.73) 11.97,17.18 arc(12.03,17.37) 12.05,17.58 12.05,17.78 arc(12.25,18.25) 12.72,18.45
  vias: v1(20.07,27.64)
5V: length 51
  Top Layer w0.381: C8.2 28.44,21.13 v1(28.44,21.83) 28.62,22.02 U31.3 28.62,23.3 arc(28.5,23.61) 28.18,23.74 27.17,23.74 arc(26.85,23.61) 26.72,23.3 26.72,22.69 ; U89.B9 U89.A4 30.85,5.96 30.85,4.68 arc(30.83,4.52) 30.78,4.36 arc(30.63,4.15) 30.41,4 arc(30.26,3.94) 30.09,3.93 29.55,3.93 arc(28.99,4.04) 28.52,4.35 25.24,7.63 arc(24.88,8.17) 24.75,8.8 24.75,9.1 arc(24.78,9.3) 24.86,9.49 arc(24.98,9.65) 25.14,9.77 arc(25.33,9.85) 25.53,9.88 U89.A9
  Top Layer w0.508: U89.A9 U89.B4
  Bottom Layer w0.381: U89.B4 27.94,13.19 arc(27.83,13.47) R32.1 arc(28.18,13.85) 28.44,14.47 v1(28.44,21.83) ; U89.A9 25.91,9.88 arc(25.3,9.76) 24.78,9.41 21.56,6.19 arc(20.74,5.64) 19.76,5.45 v1(10.53,5.45)
GND: length 28.2
  Top Layer w0.305: U5.63 15.28,22.82 arc(15.32,22.61) v1(15.44,22.44) ; U34.6 10.9,10.9 arc(11.07,11.12) 11.19,11.38 ; U5.18 15.28,12.01 15.25,11.98 15.25,10.87 arc(15.29,10.65) v1(15.42,10.46) ; U5.12 14.05,17.16 arc(14.2,17.1) v1(14.26,16.94) ; v1(11.24,11.72) 11.24,10.8 arc(11.19,10.55) U34.7 ; v1(11.24,11.72) arc(11.2,11.92) 11.08,12.09 10.7,12.48 arc(10.3,12.75) 9.83,12.84 v1(9.8,12.84) arc(9.83,12.69) 9.91,12.56 11.02,11.45 arc(11.1,11.4) 11.19,11.38 ; v1(11.24,11.72) arc(11.22,11.55) 11.19,11.38
  Top Layer w0.381: C8.1 27.02,21.12 arc(27.37,21.57) 27.59,22.09 arc(27.65,22.39) U31.2
  Top Layer w0.508: 32.61,6.17 33.18,5.6 v1(33.86,5.6) ; v1(30.98,27.55) 30.98,28.14 U90.1 34.31,31.47 v1(34.82,31.47) ; v1(33.24,9.56) 33.24,8.71 U89.19 ; v1(31.92,3.95) 31.92,4.95 31.66,5.21
  Bottom Layer w0.508: v1(26.74,12.73) 26.74,12.04 27.17,11.61 ; 26.21,10.66 25.14,11.73 v1(25.14,11.74)
  vias: v1(4.12,8.6) v1(4.31,28.44) v1(4.59,26.89) v1(5.45,29.45) v1(5.43,8.53) v1(5.93,27.43) v1(6.59,30.6) v1(6.59,13.9) v1(6.72,7.7) v1(6.85,26.53) v1(7.14,21.63) v1(7.14,20.56) v1(7.1,12.85) v1(7.28,19.55) v1(7.43,11.08) v1(7.44,10.13) v1(7.49,18.18) v1(7.53,14.54) v1(7.51,6.75) v1(7.58,16.92) v1(7.74,31.74) v1(7.94,9.18) v1(7.99,27.29) v1(8.12,29.45) v1(8.12,25.13) v1(8.12,16.33) v1(8.06,13.8) v1(8.33,7.76) v1(8.43,5.27) v1(8.51,6.49) v1(8.58,4.1) v1(8.84,14.59) v1(9.01,32.75) v1(9.01,28.18) v1(9.09,26.73) v1(9.34,11.02) v1(9.77,7.05) v1(10.16,9.14) v1(10.35,7.76) v1(10.4,28.56) v1(10.4,23.95) v1(10.53,33.39) v1(10.66,27.29) v1(10.62,21.42) v1(10.63,13.71) v1(10.78,32.12) v1(10.78,29.96) v1(11.06,14.51) v1(11.55,25.13) v1(11.55,6.94) v1(11.67,26.28) v1(11.71,9.01) v1(12.46,14.19) v1(12.69,25.13) v1(12.69,23.99) v1(12.68,7.68) v1(12.82,30.6) v1(13.35,14.22) v1(13.7,29.83) v1(13.93,6.65) v1(14.38,15.71) v1(14.46,9.21) v1(15.37,28.15) v1(15.39,16.51) v1(15.54,20.87) v1(15.92,6.91) v1(16.24,30.85) v1(16.42,17.56) v1(16.58,18.89) v1(17.51,20.62) v1(17.54,16.66) v1(17.5,9.44) v1(17.6,18.91) v1(17.9,30.6) v1(18.04,10) v1(18.4,17.01) v1(18.53,21.62) v1(18.53,19.78) v1(18.63,15.27) v1(19.34,30.6) v1(19.55,22.59) v1(19.8,21.07) v1(19.8,18.78) v1(19.9,17.01) v1(20.08,15.17) v1(20.08,6.98) v1(20.49,22.59) v1(20.49,8.35) v1(20.57,30.6) v1(21.07,22.21) v1(21.07,19.93) v1(21.36,17.01) v1(21.34,11.7) v1(21.71,18.78) v1(22.21,21.07) v1(22.34,30.72) v1(22.59,16.88) v1(22.72,19.55) v1(22.72,15.86) v1(22.98,14.09) v1(23.1,23.99) v1(23.59,6.96) v1(24.12,11.68) v1(24.1,10.74) v1(24.25,14.47) v1(24.25,13.67) v1(24.22,9.96) v1(24.37,27.55) v1(24.5,24.25) v1(24.92,6.94) v1(25.11,13.66) v1(25.64,30.85) v1(25.84,16.16) v1(25.84,12.62) v1(25.88,18.16) v1(26.02,26.91) v1(26.4,14) v1(26.73,16.55) v1(26.68,5.02) v1(26.79,33.39) v1(26.79,32.1) v1(26.78,18.16) v1(26.98,21.61) v1(27.56,25.79) v1(27.56,25.03) v1(27.56,24.39) v1(27.49,4.21) v1(27.63,7.34) v1(27.71,30.85) v1(27.67,22.07) v1(27.67,18.16) v1(27.67,16.14) v1(28.31,32.88) v1(28.69,33.9) v1(28.82,31.87) v1(29.58,26.06) v1(29.58,25.06) v1(29.58,24.12) v1(29.58,22.21) v1(29.58,21.32) v1(29.83,27.8) v1(30.34,20.82) v1(30.34,16.44) v1(30.47,26.79) v1(30.47,25.7) v1(30.47,24.47) v1(30.7,22.21) v1(30.87,3.23) v1(30.99,21.32) v1(31.1,29.2) v1(31.36,34.66) v1(31.74,11.18) v1(31.87,26.79) v1(32.12,33.9) v1(32.25,28.44) v1(32.5,10.42) v1(32.91,4.87) v1(33.14,33.01) v1(33.3,26.79) v1(33.38,11.21) v1(33.54,28.44) v1(33.9,32.25) v1(33.96,7.01) v1(34.07,8.38)
VBAT: length 12.7
  Bottom Layer w0.203: R26.1 7.1,8.5 arc(6.29,8.83) v1(5.96,9.64)
ADC_BAT: length 7.8
  Top Layer w0.203: U5.25 18.78,14.11 arc(18.82,14.33) 18.95,14.52
  Bottom Layer w0.203: R26.2 R27.1 19.11,10.45 arc(18.87,10.81) 18.78,11.23 18.78,14.02 arc(18.84,14.31) v1(19.01,14.56)
ADC_CURRENT: length 11.2
  Top Layer w0.203: v1(21.2,8.5) 21.41,8.5 arc(21.92,8.29) 22.13,7.77 22.13,5.79 ; 18.29,13.99 18.29,14.5 arc(18.3,14.56) 18.33,14.61
  Inner1 w0.203: v1(21.2,8.5) 19.02,10.67 arc(18.47,11.5) 18.28,12.47 18.28,14.47 arc(18.29,14.56) v1(18.34,14.63)
ADC_RSSI: length 13.5
  Top Layer w0.178: U5.27 19.78,14.4 arc(19.75,14.53) v1(19.68,14.65)
  Top Layer w0.203: v1(22.47,9.64) 23.23,9.64 arc(23.86,9.38) 24.12,8.75 24.12,7.49 arc(24.18,7.04) 24.34,6.62 arc(24.48,6.41) 24.65,6.22 24.82,6.04
  Inner1 w0.203: v1(19.68,14.65) 19.68,11.5 arc(19.79,10.95) 20.1,10.49 20.45,10.13 arc(21,9.77) 21.64,9.64 v1(22.47,9.64)
BEEP-: length 10.8
  Bottom Layer w0.305: v1(22.46,8.81) 21.97,8.32 arc(21.19,7.79) 20.26,7.61 14.47,7.61 arc(13.39,7.16) v1(12.94,6.08)
BEEPER: length 17.1
  Top Layer w0.178: R35.1 20.44,11.17 v1(20.44,11.67)
  Top Layer w0.203: U5.2 14.14,22.16 arc(14.18,22.14) v1(14.2,22.1)
  Inner1 w0.203: v1(14.2,22.1) 14.6,21.71 arc(14.82,21.37) 14.9,20.97 14.9,19.3 arc(15.91,16.87) 18.34,15.86 19.83,15.86 arc(19.96,15.85) 20.09,15.83 arc(20.53,15.58) 20.78,15.14 arc(20.81,15.01) 20.82,14.88 20.82,12.59 arc(20.81,12.43) 20.77,12.26 arc(20.64,11.94) v1(20.44,11.67)
BOOT0: length 6.8
  Top Layer w0.203: U5.60 v1(16.78,26.02)
  Inner1 w0.203: v1(12.88,27.93) 13.82,27.93 arc(14.8,27.74) 15.62,27.18 v1(16.78,26.02)
  Bottom Layer w0.381: v1(12.88,27.93) R28.1
BOOT1: length 4.5
  Top Layer w0.178: U5.28 20.28,14.41 arc(20.29,14.45) v1(20.31,14.49)
  Bottom Layer w0.203: v1(20.31,14.49) 20.31,12.89 arc(20.21,12.36) 19.91,11.92 R25.1
DAC: length 10.5
  Top Layer w0.178: U5.20 16.28,12.34 arc(16.34,12.02) v1(16.52,11.76)
  Top Layer w0.203: v1(18.78,6.85) 20.18,5.45 U86.4
  Inner1 w0.203: v1(18.78,6.85) 17.5,6.85 arc(16.81,7.13) 16.52,7.83 v1(16.52,11.76)
I2C1_SCL: length 10.5
  Top Layer w0.203: U79.4 17.83,27.31 v1(17.83,26.24) 17.83,24.71 U5.58
  Inner1 w0.203: v1(17.83,26.24) 17.83,27.59 arc(17.78,27.84) 17.64,28.06 15.26,30.44 arc(14.86,31.03) v1(14.72,31.74)
  Bottom Layer w0.203: 18.79,26.28 18.75,26.24 v1(17.83,26.24)
I2C1_SDA: length 11.5
  Top Layer w0.203: U5.59 v1(17.28,27.57) 17.71,28 arc(17.84,28.08) U79.3
  Inner1 w0.203: v1(17.28,27.57) 12.98,31.87 v1(12.94,31.87)
  Bottom Layer w0.203: R41.1 18.56,27.57 v1(17.28,27.57)
IMU_CS: length 10
  Top Layer w0.203: U34.12 12.02,11.32 v1(11.86,11.32) ; U5.10 12.79,18.15 v1(14.19,18.15)
  Inner1 w0.203: v1(14.19,18.15) 12.53,16.49 arc(11.99,15.68) 11.8,14.73 11.8,11.46 arc(11.82,11.38) v1(11.86,11.32)
LED0: length 10
  Top Layer w0.203: LED1.1 23.19,28.4 v1(22.59,27.8) ; U5.62 15.78,25.52 arc(15.84,25.79) v1(15.99,26.02)
  Inner1 w0.203: 21.05,26.26 v1(22.59,27.8) ; v1(15.99,26.02) 16.24,25.77 arc(16.53,25.58) 16.86,25.52 19.26,25.52 arc(20.23,25.71) 21.05,26.26
LED1: length 15.4
  Top Layer w0.178: LED2.1 29.22,29.05 arc(29.77,29.88) 29.96,30.85 v1(29.96,32.25)
  Top Layer w0.203: U5.49 v1(22.85,24.66)
  Inner1 w0.203: v1(22.85,24.66) 29.63,31.44 arc(29.87,31.81) v1(29.96,32.25)
LED_STRIP: length 8.3
  Top Layer w0.203: U5.50 v1(21.78,25.9)
  Inner1 w0.203: v1(24.88,31.74) 24.88,30.05 arc(24.69,29.08) 24.14,28.25 v1(21.78,25.9)
LSM_MISO: length 8.1
  Top Layer w0.203: U34.1 11.18,12.7 11.71,13.23 arc(11.99,13.42) 12.33,13.49 v1(12.72,13.49) ; v1(17.27,14.41) 17.28,14.41 U5.22
  Inner2 w0.203: v1(17.27,14.41) 17.1,14.24 arc(17.04,14.18) 16.97,14.12 arc(16.19,13.65) 15.3,13.49 v1(12.72,13.49)
LSM_MOSI: length 8.7
  Top Layer w0.203: v1(16.98,15.13) 17.31,15.13 arc(17.64,15) 17.78,14.66 U5.23 ; U34.14 12.24,12.94 v1(12.31,12.94)
  Inner1 w0.203: v1(12.31,12.94) 12.8,12.94 arc(13.48,13.08) 14.05,13.46 15.29,14.7 arc(15.77,15.02) 16.34,15.13 v1(16.98,15.13)
LSM_SCK: length 6.6
  Top Layer w0.203: v1(13.2,12.43) 12.6,12.43 arc(12.44,12.4) 12.3,12.31 ; U5.21 16.78,13.98 arc(16.71,14.32) v1(16.52,14.61)
  Inner1 w0.203: v1(16.52,14.61) arc(15.93,14.49) 15.42,14.15 14.06,12.79 arc(13.67,12.53) v1(13.2,12.43)
NRST: length 11.4
  Top Layer w0.203: v1(14.34,21.08) 14.34,20.05 arc(14.22,19.78) 13.95,19.66 U5.7
  Inner2 w0.178: v1(10.25,25.17) 10.25,25.17 v1(14.34,21.08)
  Bottom Layer w0.203: 7.81,24.27 9.4,24.27 10.25,25.12 v1(10.25,25.17)
OSCIN: length 6.5
  Top Layer w0.203: C9.2 8.69,20.97 X3.1 arc(8.54,20.68) 8.6,20.59 9.29,19.9 arc(9.54,19.73) 9.83,19.67 10.53,19.67 arc(10.76,19.72) 10.96,19.85 11.61,20.5 arc(11.77,20.61) 11.95,20.66 arc(11.98,20.66) 12.01,20.66
OSCOUT: length 5.2
  Top Layer w0.203: 10.09,16.63 10.21,16.75 X3.3 11.48,19.87 arc(11.81,20.09) 12.19,20.16 U5.6
PA0: length 11.2
  Top Layer w0.203: U5.14 11.24,16.16 arc(11.06,16.13) 10.91,16.02 10.73,15.84 arc(10.47,15.67) 10.16,15.61 7.74,15.61 arc(7.11,15.87) 6.85,16.5 6.85,18.53 arc(6.36,19.7) U87.3
PA1: length 7.6
  Top Layer w0.203: v1(11.25,15.66) 12.78,15.66 U5.15
  Inner1 w0.203: v1(11.25,15.66) 7.69,15.66 arc(6.55,16.13) v1(6.08,17.26)
PA2: length 6.7
  Top Layer w0.203: 12.78,15.16 v1(10.75,15.16)
  Inner1 w0.203: v1(10.75,15.16) 6.09,15.16
  vias: v1(6.08,15.16)
PA3: length 18.7
  Top Layer w0.178: 15.75,9.12 Q2.3 ; v1(6.47,11.67) 5.58,12.56 U87.6 ; R20.1 16.38,10.17 arc(16.31,9.81) 16.1,9.5 v1(15.74,9.13) 15.15,9.72 arc(14.88,10.13) 14.78,10.61 U5.17
  Inner1 w0.178: v1(6.47,11.67) 9.62,11.67 arc(10.23,11.55) 10.74,11.21 11.44,10.51 arc(12.26,9.96) 13.23,9.77 14.2,9.77 arc(15.03,9.6) v1(15.74,9.13)
PA8: length 13.9
  Top Layer w0.203: U5.41 29.84,19.16 arc(30.64,18.83) 30.98,18.02 30.98,13.93 arc(30.99,13.72) 31.04,13.51 arc(31.38,12.96) 31.93,12.63 arc(32.13,12.58) 32.34,12.56 U83.1
PA9: length 8.2
  Top Layer w0.203: U5.42 29.77,19.66 arc(29.96,19.65) 30.14,19.62 arc(30.99,19.16) 31.46,18.3 arc(31.49,18.12) 31.49,17.94
PA10: length 8.4
  Top Layer w0.203: U5.43 32.61,20.16 U83.4
PA11: length 13.3
  Top Layer w0.203: v1(22.98,20.56) 23.07,20.66 U5.44
  Inner1 w0.203: v1(30.31,15.61) 29.94,15.97 arc(29.39,16.8) 29.2,17.77 29.2,19.57 arc(28.86,20.38) 28.05,20.72 23.34,20.72 arc(23.14,20.68) v1(22.98,20.56)
  Bottom Layer w0.203: v1(30.31,15.61) 30.34,15.61 R30.1
PA12: length 13.5
  Top Layer w0.203: U5.45 23.01,21.16 v1(22.98,21.2)
  Inner1 w0.203: v1(29.71,17.9) 29.71,19.55 arc(29.27,20.61) 28.21,21.04 23.34,21.04 arc(23.14,21.08) v1(22.98,21.2)
  Bottom Layer w0.203: v1(29.71,17.9) 29.71,16.01 arc(29.61,15.51) R34.1
PA13: length 13.1
  Top Layer w0.203: U5.46 25.3,21.66 arc(25.69,21.74) v1(26.02,21.96)
  Inner2 w0.203: v1(31.36,30.85) 26.11,25.6 arc(25.76,25.08) 25.64,24.48 25.64,22.88 arc(25.74,22.38) v1(26.02,21.96)
PB3: length 8.9
  Top Layer w0.203: v1(16.02,20.12) 16.06,20.12 18.91,22.98 arc(19.18,23.38) 19.28,23.87 U5.55
  Bottom Layer w0.203: CARD1.5 14.6,19.54 arc(15.37,19.69) v1(16.02,20.12)
PB4: length 7.6
  Top Layer w0.203: v1(16.14,21.6) 16.68,21.6 arc(16.88,21.64) 17.04,21.75 18.4,23.1 arc(18.68,23.53) 18.78,24.03 U5.56
  Bottom Layer w0.203: 13.21,21.86 13.47,21.6 v1(16.14,21.6)
PB5: length 9.6
  Top Layer w0.203: U5.57 18.28,23.93 arc(18.23,23.69) 18.1,23.48 v1(16.75,22.13)
  Bottom Layer w0.203: v1(16.75,22.13) 16.75,20.44 arc(16.67,20.05) 16.45,19.72 14.51,17.78 arc(14.29,17.64) 14.03,17.59 13.34,17.59
PB8: length 12.4
  Top Layer w0.203: U5.61 v1(16.28,23.1)
  Inner1 w0.203: v1(6.08,24.88) 7.06,23.9 arc(7.89,23.35) 8.86,23.16 16.23,23.16 v1(16.28,23.1)
PB12: length 3.3
  Top Layer w0.203: U5.33 26,15.16 v1(26.02,15.13)
  Bottom Layer w0.203: v1(26.02,15.13) 27.51,15.13 R32.2
PC1: length 5.8
  Top Layer w0.203: v1(14.97,17.13) 14.97,18.02 arc(14.79,18.47) 14.34,18.66 U5.9
  Bottom Layer w0.203: CARD1.2 14.08,16.24 arc(14.71,16.5) v1(14.97,17.13)
PC6: length 8.5
  Top Layer w0.203: U5.37 v1(30.47,17.16)
  Inner1 w0.203: v1(31.87,15.61) 31.87,15.76 arc(31.46,16.75) v1(30.47,17.16)
PC7: length 16.9
  Top Layer w0.203: U84.2 22.72,32.18 v1(23.16,31.75) ; U5.38 23.02,17.66 v1(22.99,17.62)
  Inner2 w0.203: v1(22.99,17.62) 22.99,17.63 arc(23.54,18.45) 23.74,19.43 23.74,30.35 arc(23.59,31.11) v1(23.16,31.75)
PC8: length 19.7
  Top Layer w0.203: v1(22.55,18.15) 24.27,18.15 U5.39
  Inner2 w0.203: v1(6.08,22.34) 6.09,22.35 9.96,22.35 arc(10.93,22.15) 11.76,21.6 14.47,18.89 arc(15.29,18.34) 16.26,18.15 v1(22.55,18.15)
PC9: length 20.8
  Top Layer w0.203: v1(16.37,6.21) 16.12,6.21 U86.2 ; v1(22.97,18.67) 24.27,18.67 U5.40
  Inner1 w0.178: v1(16.37,6.21) 19.51,6.21 arc(20.48,6.4) 21.31,6.96 22.74,8.39 arc(23.29,9.21) 23.48,10.18 23.48,17.42 arc(23.35,18.1) v1(22.97,18.67)
PC10: length 12.1
  Top Layer w0.203: U5.51 21.28,23.02 v1(21.32,22.98)
  Inner1 w0.203: v1(31.74,22.98) v1(21.32,22.98)
PC11: length 13.2
  Top Layer w0.203: v1(20.77,23.41) 20.78,23.42 U5.52
  Inner1 w0.203: v1(20.77,23.41) 20.82,23.46 30.44,23.46 arc(31.45,23.87) v1(31.87,24.88)
PC12: length 11.1
  Top Layer w0.203: U5.53 20.28,23.46 arc(20.21,23.3) v1(20.05,23.23)
  Inner2 w0.203: v1(20.05,23.23) 20.05,24.46 arc(20.25,25.44) 20.8,26.26 21.52,26.99 arc(21.75,27.33) 21.83,27.73 21.83,29.42 arc(21.64,30.39) 21.09,31.21 v1(20.56,31.74)
PD2: length 8.2
  Top Layer w0.203: U5.54 19.78,26.35 arc(19.72,26.65) v1(19.55,26.91)
  Inner1 w0.203: v1(19.55,26.91) 17.57,28.88 arc(17.25,29.37) 17.13,29.95 v1(17.13,31.87)
SBUS: length 2.4
  Top Layer w0.178: U86.3 17.75,5.31 Q2.1
USB_DM: length 6.8
  Bottom Layer w0.203: R30.2 30.85,9.88 arc(30.7,9.13) U89.B7 ; 30.25,8.39 30.23,8.38 28.72,8.38
USB_DP: length 6.4
  Top Layer w0.203: 29.42,9.15 29.42,7.9 arc(29.4,7.81) 29.35,7.73
  Bottom Layer w0.203: U89.B6 29.79,9.57 arc(30.29,10.32) 30.47,11.2 30.47,11.39 arc(30.39,12.03) 30.15,12.63 arc(29.95,12.92) 29.72,13.19 R34.2
$1N7139: length 6.1
  Top Layer w0.203: U5.47 25.08,22.16 ; v1(26.15,24.25) 26.15,23.53 arc(26.05,23.02) 25.76,22.58 25.54,22.36 arc(25.33,22.22) 25.08,22.17
  Bottom Layer w0.203: C20.2 24.25,26.15 v1(26.15,24.25)
$1N7140: length 5
  Top Layer w0.203: U5.31 21.78,13.8 arc(21.69,14.23) v1(21.45,14.59)
  Bottom Layer w0.203: v1(21.45,14.59) 21.45,13.48 arc(21.59,12.81) 21.97,12.24 C21.2
$1N7387: length 3.7
  Top Layer w0.305: R35.2 22.2,10.57 Q1.1 20.89,9.25 R15.2
$1N7752: length 1.8
  Top Layer w0.203: LED1.2 25.02,30 R42.2
$1N7753: length 1.8
  Top Layer w0.203: LED2.2 28.52,29.95 R43.2
$1N11868: length 5.8
  Top Layer w0.203: U79.5 16.54,27.31 arc(16.59,27.03) v1(16.75,26.79)
  Inner2 w0.203: v1(21.22,27.56) 20.29,26.62 arc(19.91,26.37) 19.45,26.28 19.05,26.28 arc(18.8,26.33) 18.6,26.46 18.5,26.56 arc(18.25,26.73) 17.95,26.79 v1(16.75,26.79)
$1N12580: length 2.3
  Top Layer w0.203: R46.2 28.36,6.34 29.07,6.34 arc(29.63,6.45) U89.A5
$1N12606: length 2.2
  Top Layer w0.203: 28.72,10.06 arc(29.11,10.31) 29.56,10.4 29.72,10.4 arc(30.25,10.51) R47.1

## Copper pours and planes (outline as drawn; the poured copper is in the pictures)
GND on Top Layer: -3.81,41.86 43.73,41.86 43.73,-4.43 -3.81,-4.43
GND on Bottom Layer: -3.7,41.75 44.99,41.75 44.99,-5.58 -3.7,-5.58
GND on Inner1: -4.23,42.17 44.05,42.17 44.05,-4.43 -4.23,-4.43
GND on Inner2: -4.23,42.49 44.57,42.49 44.57,-5.27 -4.23,-5.27

Small or netless copper shapes (teardrops, artwork), in the pictures only: 143 on Top Layer, 61 on Bottom Layer, 39 on Inner1, 14 on Inner2

## Text on the board
Bottom Silkscreen Layer: ESC1 | ESC3 | ESC4 | ESC2
Document Layer: 3 | 2 | 4 | 1
Top Silkscreen Layer: BAT | G | 5V | WKFLY | F405
